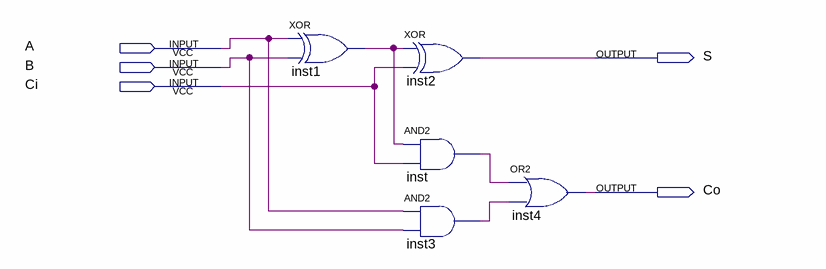
[diagram p0: schematic sheet]
// Quartus schematic somador_completo.bdf as structural Verilog: 5 symbols, 5 pins
module somador_completo (
  input  A,
  input  B,
  input  Ci,
  output S,
  output Co
);

  wire inst1_out, inst3_out, inst_out;

  xor inst1 (inst1_out, A, B);
  xor inst2 (S, inst1_out, Ci);
  and inst (inst_out, inst1_out, Ci);
  and inst3 (inst3_out, A, B);
  or inst4 (Co, inst_out, inst3_out);
endmodule
